# EAGLE design LED_Matrix_3_1 (EAGLE 8.2.2)
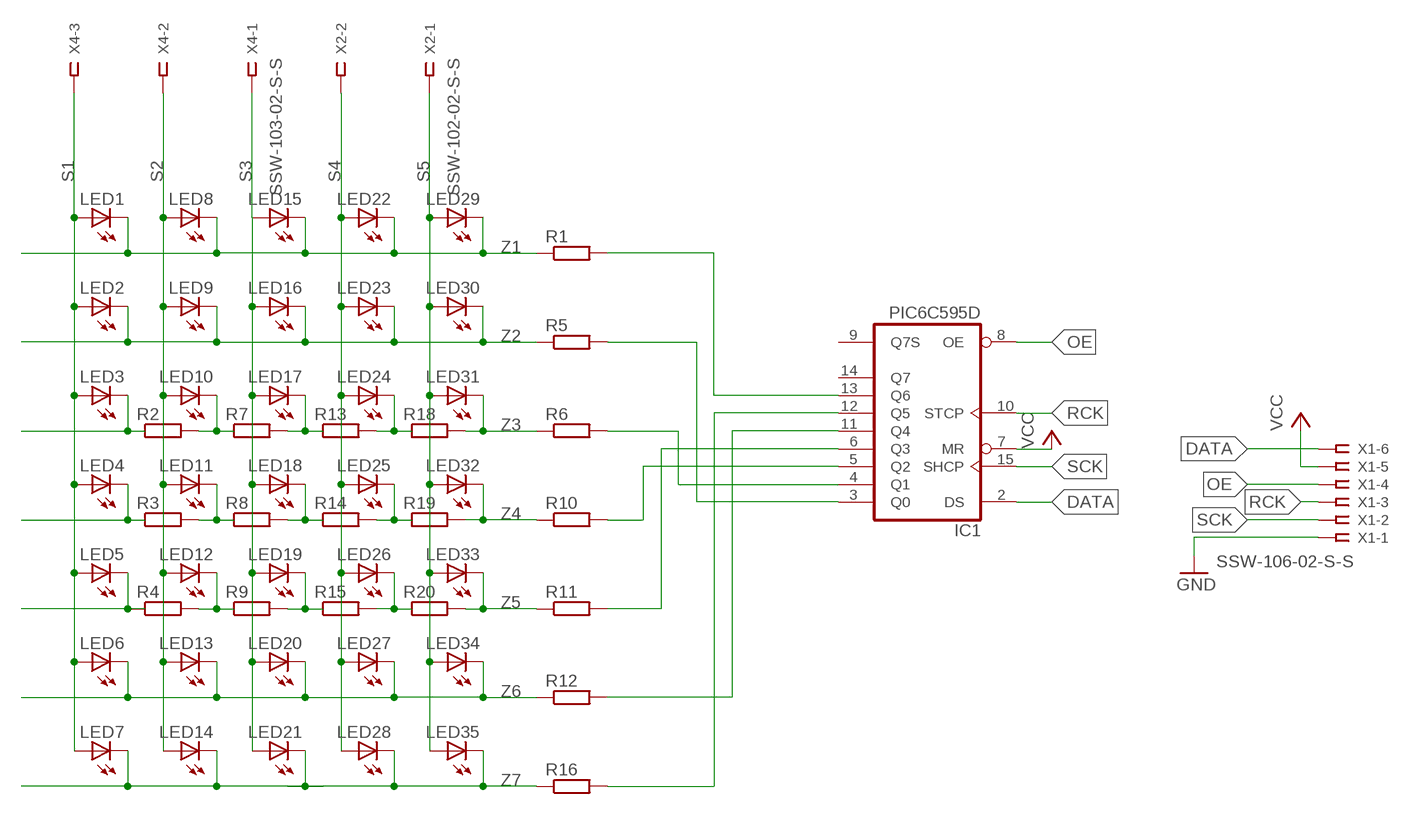
[diagram p0: schematic, sheet 1]

## Parts
IC1  PIC6C595D  [SO16]
LED1  LEDCHIP-LED0603  [CHIP-LED0603]
LED2  LEDCHIP-LED0603  [CHIP-LED0603]
LED3  LEDCHIP-LED0603  [CHIP-LED0603]
LED4  LEDCHIP-LED0603  [CHIP-LED0603]
LED5  LEDCHIP-LED0603  [CHIP-LED0603]
LED6  LEDCHIP-LED0603  [CHIP-LED0603]
LED7  LEDCHIP-LED0603  [CHIP-LED0603]
LED8  LEDCHIP-LED0603  [CHIP-LED0603]
LED9  LEDCHIP-LED0603  [CHIP-LED0603]
LED10  LEDCHIP-LED0603  [CHIP-LED0603]
LED11  LEDCHIP-LED0603  [CHIP-LED0603]
LED12  LEDCHIP-LED0603  [CHIP-LED0603]
LED13  LEDCHIP-LED0603  [CHIP-LED0603]
LED14  LEDCHIP-LED0603  [CHIP-LED0603]
LED15  LEDCHIP-LED0603  [CHIP-LED0603]
LED16  LEDCHIP-LED0603  [CHIP-LED0603]
LED17  LEDCHIP-LED0603  [CHIP-LED0603]
LED18  LEDCHIP-LED0603  [CHIP-LED0603]
LED19  LEDCHIP-LED0603  [CHIP-LED0603]
LED20  LEDCHIP-LED0603  [CHIP-LED0603]
LED21  LEDCHIP-LED0603  [CHIP-LED0603]
LED22  LEDCHIP-LED0603  [CHIP-LED0603]
LED23  LEDCHIP-LED0603  [CHIP-LED0603]
LED24  LEDCHIP-LED0603  [CHIP-LED0603]
LED25  LEDCHIP-LED0603  [CHIP-LED0603]
LED26  LEDCHIP-LED0603  [CHIP-LED0603]
LED27  LEDCHIP-LED0603  [CHIP-LED0603]
LED28  LEDCHIP-LED0603  [CHIP-LED0603]
LED29  LEDCHIP-LED0603  [CHIP-LED0603]
LED30  LEDCHIP-LED0603  [CHIP-LED0603]
LED31  LEDCHIP-LED0603  [CHIP-LED0603]
LED32  LEDCHIP-LED0603  [CHIP-LED0603]
LED33  LEDCHIP-LED0603  [CHIP-LED0603]
LED34  LEDCHIP-LED0603  [CHIP-LED0603]
LED35  LEDCHIP-LED0603  [CHIP-LED0603]
R1  R-EU_R0603  [R0603]
R2  R-EU_R0603  [R0603]
R3  R-EU_R0603  [R0603]
R4  R-EU_R0603  [R0603]
R5  R-EU_R0603  [R0603]
R6  R-EU_R0603  [R0603]
R7  R-EU_R0603  [R0603]
R8  R-EU_R0603  [R0603]
R9  R-EU_R0603  [R0603]
R10  R-EU_R0603  [R0603]
R11  R-EU_R0603  [R0603]
R12  R-EU_R0603  [R0603]
R13  R-EU_R0603  [R0603]
R14  R-EU_R0603  [R0603]
R15  R-EU_R0603  [R0603]
R16  R-EU_R0603  [R0603]
R18  R-EU_R0603  [R0603]
R19  R-EU_R0603  [R0603]
R20  R-EU_R0603  [R0603]
X1  SSW-106-02-S-S  [SSW-106-02-S-S]
X2  SSW-102-02-S-S  [SSW-102-02-S-S]
X4  SSW-103-02-S-S  [SSW-103-02-S-S]

## Nets
DATA: IC1.2(DS) X1.6
GND: X1.1
N$1: IC1.13(Q6) R1.2
N$2: IC1.12(Q5) R16.2
N$3: IC1.11(Q4) R12.2
N$4: IC1.4(Q1) R6.2
N$5: IC1.3(Q0) R5.2
N$6: IC1.6(Q3) R11.2
N$7: IC1.5(Q2) R10.2
N$9: LED4.C R3.1
N$17: LED10.C R2.2 R7.1
N$18: LED17.C R7.2 R13.1
N$19: LED24.C R13.2 R18.1
N$21: LED25.C R14.2 R19.1
N$22: LED18.C R8.2 R14.1
N$23: LED11.C R3.2 R8.1
N$29: LED12.C R4.2 R9.1
N$30: LED19.C R9.2 R15.1
N$35: LED26.C R15.2 R20.1
N$36: LED5.C R4.1
N$53: LED3.C R2.1
OE: IC1.8(OE) X1.4
RCK: IC1.10(STCP) X1.3
S1: LED1.A LED2.A LED3.A LED4.A LED5.A LED6.A LED7.A X4.3
S2: LED8.A LED9.A LED10.A LED11.A LED12.A LED13.A LED14.A X4.2
S3: LED15.A LED16.A LED17.A LED18.A LED19.A LED20.A LED21.A X4.1
S4: LED22.A LED23.A LED24.A LED25.A LED26.A LED27.A LED28.A X2.2
S5: LED29.A LED30.A LED31.A LED32.A LED33.A LED34.A LED35.A X2.1
SCK: IC1.15(SHCP) X1.2
VCC: IC1.7(MR) X1.5
Z1: LED1.C LED8.C LED15.C LED22.C LED29.C R1.1
Z2: LED2.C LED9.C LED16.C LED23.C LED30.C R5.1
Z3: LED31.C R6.1 R18.2
Z4: LED32.C R10.1 R19.2
Z5: LED33.C R11.1 R20.2
Z6: LED6.C LED13.C LED20.C LED27.C LED34.C R12.1
Z7: LED7.C LED14.C LED21.C LED28.C LED35.C R16.1
Unconnected: IC1.9(Q7S) IC1.14(Q7)

## Power pins joined to a net without a drawn wire
GND: IC1.16(GND)
VCC: IC1.1(VCC)

## Library data of the parts
IC1 = PIC6C595:PIC6C595: Power Logic 8-Bit Shift Register The PIC6C595 is an 8-bit serial-in/serial or parallel-out shift register with a storage register and open-drain outputs designed for use in systems that require relatively moderate load power such as LEDs. The device contains a built-in voltage clamp on the outputs for inductive transient protection. Power driver applications include relays, solenoids, and other low-current or medium-voltage loads.
LED1-LED35 = led:LED: LED OSRAM: - CHIPLED LG R971, LG N971, LY N971, LG Q971, LY Q971, LO R971, LY R971 LH N974, LH R974 LS Q976, LO Q976, LY Q976 LO Q996 - Hyper CHIPLED LW Q18S LB Q993, LB Q99A, LB R99A - SideLED LS A670, LO A670, LY A670, LG A670, LP A670 LB A673, LV A673, LT A673, LW A673 LH A674 LY A675 LS A676, LA A676, LO A676, LY A676, LW A676 LS A679, LY A679, LG A679 - Hyper Micro SIDELED® LS Y876, LA Y876, LO Y876, LY Y876 LT Y87S - SmartLED LW L88C, LW L88S LB L89C, LB L89S, LG L890 LS L89K, LO L89K, LY L89K LS L896, LA L896, LO L896, LY L896 - TOPLED LS T670, LO T670, LY T670, LG T670, LP T670 LSG T670, LSP T670, LSY T670, LOP T670, LYG T670 LG T671, LOG T671, LSG T671 LB T673, LV T673, LT T673, LW T673 LH T674 LS T676, LA T676, LO T676, LY T676, LB T676, LH T676, LSB T676, LW T676 LB T67C, LV T67C, LT T67C, LS T67K, LO T67K, LY T67K, LW E67C LS E67B, LA E67B, LO E67B, LY E67B, LB E67C, LV E67C, LT E67C LW T67C LS T679, LY T679, LG T679 LS T770, LO T770, LY T770, LG T770, LP T770 LB T773, LV T773, LT T773, LW T773 LH T774 LS E675, LA E675, LY E675, LS T675 LS T776, LA T776, LO T776, LY T776, LB T776 LHGB T686 LT T68C, LB T68C - Hyper Mini TOPLED® LB M676 - Mini TOPLED Santana® LG M470 LS M47K, LO M47K, LY M47K Source: http://www.osram.convergy.de LUXEON: - LUMILED® LXK2-PW12-R00, LXK2-PW12-S00, LXK2-PW14-U00, LXK2-PW14-V00 LXK2-PM12-R00, LXK2-PM12-S00, LXK2-PM14-U00 LXK2-PE12-Q00, LXK2-PE12-R00, LXK2-PE12-S00, LXK2-PE14-T00, LXK2-PE14-U00 LXK2-PB12-K00, LXK2-PB12-L00, LXK2-PB12-M00, LXK2-PB14-N00, LXK2-PB14-P00, LXK2-PB14-Q00 LXK2-PR12-L00, LXK2-PR12-M00, LXK2-PR14-Q00, LXK2-PR14-R00 LXK2-PD12-Q00, LXK2-PD12-R00, LXK2-PD12-S00 LXK2-PH12-R00, LXK2-PH12-S00 LXK2-PL12-P00, LXK2-PL12-Q00, LXK2-PL12-R00 Source: www.luxeon.com KINGBRIGHT: KA-3528ASYC Source: www.kingbright.com
R1 R5 R6 R10-R12 R16 = resistor:R-EU_: RESISTOR, European symbol
R2-R4 R7-R9 R13-R15 R18-R20 = rcl:R-EU_: RESISTOR, European symbol
X1 = con-samtec:SSW-106-02-S-S: THROUGH-HOLE .025" SQ POST SOCKET Source: Samtec SSW.pdf; MPN: SSW-106-02-S-S; OC_FARNELL: unknown; OC_NEWARK: 11P9416
X2 = con-samtec:SSW-102-02-S-S: THROUGH-HOLE .025" SQ POST SOCKET Source: Samtec SSW.pdf; MPN: SSW-102-02-S-S; OC_FARNELL: unknown; OC_NEWARK: 11P9351
X4 = con-samtec:SSW-103-02-S-S: THROUGH-HOLE .025" SQ POST SOCKET Source: Samtec SSW.pdf; MPN: SSW-103-02-S-S; OC_FARNELL: unknown; OC_NEWARK: 11P9367

## Board
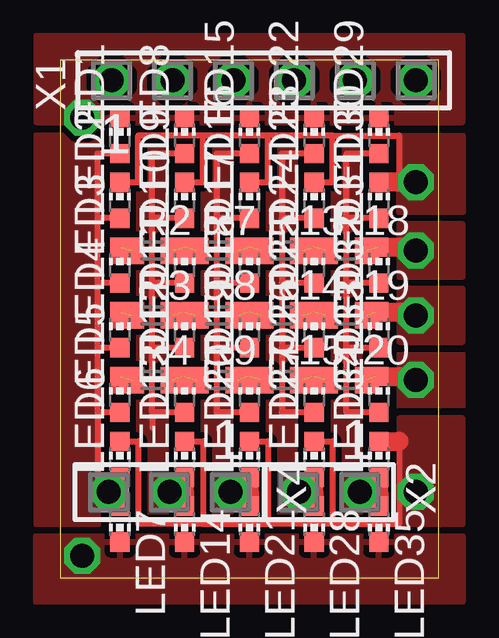
[diagram p1: board, top side]
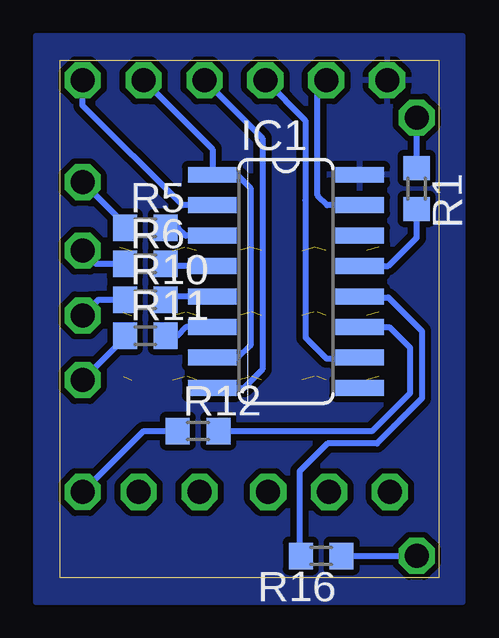
[diagram p2: board, bottom side, seen from below]

Size 15.8 x 21.6 mm. Coordinates in mm from the lower left corner, seen from the top.
Outline: 0,0 15.8,0 15.8,21.6 0,21.6 0,0
Copper layers (1*16): Top 0.035mm / dielectric 1.5mm / Bottom 0.035mm
Design rules "default *": minimum track width 10mil, minimum drill 24mil, track to track 10mil, track to pad 10mil, pad to pad 10mil, via to via 10mil, smd to smd 8mil, copper to edge 0mil, drill to drill 8mil, minimum pad ring 10mil, minimum via ring 8mil, stop-mask expansion 4mil, vias tented up to drill 0mil, thermal gap 10mil

### Footprints (pad centres in the part's own frame; a part is rotated, then mirrored left to right if it is on the bottom)
SO16 = smd 0.66 x 2.032: 1 -4.445,-3.073; 2 -3.175,-3.073; 3 -1.905,-3.073; 4 -0.635,-3.073; 5 0.635,-3.073; 6 1.905,-3.073; 7 3.175,-3.073; 8 4.445,-3.073; 9 4.445,3.073; 10 3.175,3.073; 11 1.905,3.073; 12 0.635,3.073; 13 -0.635,3.073; 14 -1.905,3.073; 15 -3.175,3.073; 16 -4.445,3.073
CHIP-LED0603 = smd 0.8 x 0.8: A 0,-0.75; C 0,0.75
R0603 = smd 1 x 1.1: 1 -0.85,0; 2 0.85,0
SSW-106-02-S-S = drill 1 pad 1.5 octagon: 1 -6.35,0; 2 -3.81,0; 3 -1.27,0; 4 1.27,0; 5 3.81,0; 6 6.35,0
SSW-102-02-S-S = drill 1 pad 1.5 octagon: 1 -1.27,0; 2 1.27,0
SSW-103-02-S-S = drill 1 pad 1.5 octagon: 1 -2.54,0; 2 0,0; 3 2.54,0

### Placement (x,y rotation side)
IC1  6.37,12.37 270 bottom
LED1  2.5,18.45 0 top
LED2  2.5,15.75 0 top
LED3  2.5,13.05 0 top
LED4  2.5,10.35 0 top
LED5  2.5,7.65 0 top
LED6  2.5,4.95 0 top
LED7  2.5,2.25 180 top
LED8  5.2,18.45 0 top
LED9  5.2,15.75 0 top
LED10  5.2,13.05 0 top
LED11  5.2,10.35 0 top
LED12  5.2,7.65 0 top
LED13  5.2,4.95 0 top
LED14  5.2,2.25 180 top
LED15  7.9,18.45 0 top
LED16  7.9,15.75 0 top
LED17  7.9,13.05 0 top
LED18  7.9,10.35 0 top
LED19  7.9,7.65 0 top
LED20  7.9,4.95 0 top
LED21  7.9,2.25 180 top
LED22  10.6,18.45 0 top
LED23  10.6,15.75 0 top
LED24  10.6,13.05 0 top
LED25  10.6,10.35 0 top
LED26  10.6,7.65 0 top
LED27  10.6,4.95 0 top
LED28  10.6,2.25 180 top
LED29  13.3,18.45 0 top
LED30  13.3,15.75 0 top
LED31  13.3,13.05 0 top
LED32  13.3,10.35 0 top
LED33  13.3,7.65 0 top
LED34  13.3,4.95 0 top
LED35  13.3,2.25 180 top
R1  0.92,16.24 270 bottom
R2  3.85,13.65 0 top
R3  3.85,10.95 0 top
R4  3.85,8.25 0 top
R5  12.23,14.6 0 bottom
R6  12.23,13.1 0 bottom
R7  6.55,13.65 0 top
R8  6.55,10.95 0 top
R9  6.55,8.25 0 top
R10  12.23,11.6 0 bottom
R11  12.23,10.1 0 bottom
R12  10.03,6.13 0 bottom
R13  9.25,13.65 0 top
R14  9.25,10.95 0 top
R15  9.25,8.25 0 top
R16  4.9,0.92 180 bottom
R18  11.95,13.65 0 top
R19  11.95,10.95 0 top
R20  11.95,8.25 0 top
X1  8.5,20.75 0 top
X2  11.24,3.58 180 top
X4  4.57,3.58 180 top

### Tracks (layer width: path | path; a pad name or v marks a point on that pad's centre or on a via)
DATA
  Bottom 0.254: IC1.2 10.69,15.54 14.85,19.7 X1.6
GND
  pour Bottom: -1,22.6 16.8,22.6 16.8,-1 -1,-1
N$1
  Bottom 0.254: IC1.13 3.28,13.01 2.1,13.01 0.92,14.19 R1.2
N$2
  Bottom 0.254: IC1.12 3.27,11.7 2.1,11.7 0.69,10.29 0.69,7.49 2.58,5.61 4.64,5.61 5.8,4.45 5.8,0.97 R16.2
N$3
  Bottom 0.254: R12.2 9.18,6.12 2.79,6.12 1.2,7.7 1.2,9.6 2.06,10.46 IC1.11
N$4
  Bottom 0.254: IC1.4 11.38,13 R6.2
N$5
  Bottom 0.254: IC1.3 10.54,14.27 10.87,14.6 R5.2
N$6
  Bottom 0.254: IC1.6 10.54,10.46 10.9,10.1 R11.2
N$7
  Bottom 0.254: IC1.5 11.25,11.73 R10.2
N$9  (1 unrouted)
N$17  (2 unrouted)
N$18  (2 unrouted)
N$19  (2 unrouted)
  Top 0.254: 10.49,13.77 LED24.C 10.49,13.77
  Top 0.406: 10.49,13.76 LED24.C
N$21  (2 unrouted)
  Top 0.254: 10.49,11.08 LED25.C
N$22  (2 unrouted)
  Top 0.254: 7.81,11.08 LED18.C
  Top 0.406: 7.81,11.08 LED18.C
N$23  (2 unrouted)
  Top 0.406: 5.07,11.08 LED11.C
N$29  (2 unrouted)
  Top 0.406: 5.07,8.41 LED12.C
N$30  (2 unrouted)
  Top 0.254: 7.81,8.41 LED19.C
  Top 0.406: 7.81,8.41 LED19.C
N$35  (2 unrouted)
  Top 0.254: 10.5,8.4 LED26.C 10.5,8.41
  Top 0.406: 10.5,8.4 LED26.C
N$36  (1 unrouted)
N$53  (1 unrouted)
OE
  Bottom 0.254: IC1.8 8.13,7.92 7.35,8.7 7.35,18.33 X1.4
RCK
  Bottom 0.254: IC1.10 3.33,9.15 4.68,9.15 5.55,10.02 5.55,15.73 5.56,15.74 5.56,19.08 X1.3
S1
  Top 0.254: LED1.A 1.57,17.7 1.57,15 | 1.57,12.3 1.57,15 | 1.57,9.6 1.57,12.3 | 1.57,6.9 1.57,9.6 | 1.57,6.9 1.57,3.94 | LED2.A 1.57,15 | LED3.A 1.57,12.3 | LED4.A 1.57,9.6 | LED5.A 1.57,6.9 | X4.3 2.5,3.58 2.5,3.56
  Top 0.8: LED6.A 2.5,3.56 LED7.A
  pour Top (isolate 0.254, rank 2, no thermals): 1.56,18.45 -1,18.45 -1,2.25 1.6,2.25
S2
  Top 0.254: 5.07,17.77 LED8.A 3.85,17.7 3.85,15 | 3.85,12.3 3.85,15 | 3.85,9.6 3.85,12.3 | LED9.A 3.85,15 | LED10.A 3.85,12.3 | LED11.A 3.85,9.6 | LED12.A 3.85,6.9 | 3.85,6.9 3.85,9.6 | 3.85,6.9 3.85,6.26 | X4.2 5.2,3.58
  Top 0.8: LED13.A 5.2,3.58 LED14.A
  pour Top (isolate 0.254, rank 2, no thermals): 4.4,18.45 4.4,2.25 3.3,2.25 3.3,18.45
S3
  Top 0.254: 6.55,15 6.55,17.7 LED15.A | 6.55,12.3 6.55,15 | 6.55,9.6 6.55,12.3 | 6.55,9.6 6.55,6.9 LED19.A | LED16.A 6.55,15 | LED17.A 6.55,12.3 | LED18.A 6.55,9.6 | X4.1 7.9,3.58 7.9,3.6
  Top 0.8: LED20.A 7.9,3.6 LED21.A
  pour Top (isolate 0.254, rank 2, no thermals): 6,18.45 7.1,18.45 7.1,2.25 6,2.25
S4
  Top 0.254: 9.25,9.6 9.25,6.9 | 9.25,12.3 9.25,9.6 | 9.25,15 9.25,12.3 | 9.25,15 9.25,17.7 LED22.A 10.49,17.74 | 9.45,6.9 9.25,6.9 | LED26.A 9.25,6.9 | LED25.A 9.25,9.6 | LED24.A 9.25,12.3 | LED23.A 9.25,15 | X2.2 10.6,3.58 10.6,3.54
  Top 0.8: LED27.A 10.6,3.54 LED28.A
  pour Top (isolate 0.254, rank 2, no thermals): 9.8,18.45 8.7,18.45 8.7,2.25 9.8,2.25
S5
  Top 0.254: 11.95,15 11.95,17.7 LED29.A 13.16,17.74 | 11.95,12.3 11.95,15 | 11.95,9.6 11.95,12.3 | 11.95,6.9 11.95,9.6 | 11.95,6.9 11.95,6.89 | LED30.A 11.95,15 | LED31.A 11.95,12.3 | LED32.A 11.95,9.6 | LED33.A 11.95,6.9 | X2.1 13.3,3.58 13.3,3.56
  Top 0.8: LED34.A 13.3,3.56 LED35.A
  pour Top (isolate 0.254, rank 2, no thermals): 12.5,18.45 11.4,18.45 11.4,2.25 12.5,2.25
SCK
  Bottom 0.254: IC1.15 4.64,15.54 5.05,15.95 5.05,20.39 X1.2
VCC
  Bottom 0.254: IC1.1 9.41,16.84 9.35,16.77 | IC1.7 8.36,9.19 7.86,9.69 7.86,16.26 8.4,16.8 9.43,16.8 IC1.1 | X1.5 9.44,17.88 IC1.1
Z1  (via drill 1)
  Top 0.406: 5.07,19.26 LED8.C | 7.81,19.27 LED15.C
  Bottom 0.254: R1.1 v0.92,19.2
  pour Top (isolate 0.305): -1,19.01 16.8,19.01 16.8,22.6 -1,22.6
Z2  (via drill 1)
  Top 0.254: 5.07,16.52 LED9.C | 7.8,16.5 LED16.C 8.67,16.5 8.67,18.45 | 10.49,16.5 LED23.C 11.37,16.5 11.37,18.45 | 5.07,16.51 LED9.C | 5.97,18.45 3.27,18.45 3.27,16.5 LED2.C | 8.67,18.45 5.97,18.45 | 11.37,18.45 8.67,18.45 | 11.37,18.45 14.15,18.45 14.15,16.5 | LED9.C 5.97,16.5 5.97,18.45
  Top 0.8: LED30.C 14.15,16.5 v14.85,16.5
  Bottom 0.254: R5.1 13.08,14.73 v14.85,16.5
  pour Top (isolate 0.254): 14.15,18.45 16.8,18.45 16.8,15.25 14.15,15.25
Z3  (via drill 1)  (1 unrouted)
  Top 0.8: LED31.C 14.7,13.8 v14.85,13.65
  Bottom 0.254: R6.1 14.3,13.1 v14.85,13.65
  pour Top (isolate 0.254, rank 2): 14.15,14.75 14.15,12.55 16.8,12.55 16.8,14.75
Z4  (via drill 1)  (1 unrouted)
  Top 0.254: 13.16,11.08 LED32.C
  Top 0.8: LED32.C 14.7,11.1 v14.85,10.95
  Bottom 0.254: R10.1 14.2,11.6 v14.85,10.95
  pour Top (isolate 0.254): 14.15,12.05 14.15,9.85 16.8,9.85 16.8,12.05
Z5  (via drill 1)  (1 unrouted)
  Top 0.254: 13.15,8.4 LED33.C
  Top 0.406: 13.15,8.4 LED33.C
  Top 0.8: LED33.C 14.7,8.4 v14.85,8.25
  Bottom 0.254: R11.1 13.08,10.02 v14.85,8.25
  pour Top (isolate 0.305, rank 2): 14.15,9.35 14.15,7.15 16.8,7.15 16.8,9.35
Z6  (via drill 1)
  Top 0.254: 13.15,5.66 LED34.C 13.15,5.65 | 5.08,5.68 LED13.C | 7.81,5.67 LED20.C | 7.81,5.72 LED20.C | 10.49,5.67 LED27.C 11.37,5.7 11.37,2.25 | 5.08,5.67 LED13.C | 5.97,2.25 3.27,2.25 3.27,5.7 LED6.C 2.38,5.68 | 5.97,2.25 8.67,2.25 | 8.67,2.25 | 11.37,2.25 8.67,2.25 | 11.37,2.25 14.15,2.25 14.15,5.7 | LED13.C 5.97,5.7 5.97,2.25 | LED20.C 8.67,5.7 8.67,2.25 | 8.67,2.25
  Top 0.406: 13.15,5.67 LED34.C | 5.08,5.68 LED13.C | 10.49,5.66 LED27.C
  Top 0.8: LED34.C 14.15,5.7
  Bottom 0.254: v14.85,3.58 12.3,6.13 R12.1
  pour Top (isolate 0.305): 14.15,6.65 14.15,2.25 16.8,2.25 16.8,6.65
Z7  (via drill 1)
  Top 0.406: 10.49,1.51 LED28.C 10.49,1.49 | 13.15,1.5 LED35.C | 5.08,1.5 LED14.C 5.08,1.45 | 2.38,1.5 LED7.C | 7.81,1.5 LED21.C
  Bottom 0.254: 4.1,0.93 R16.1 v0.92,0.92
  pour Top (isolate 0.254): 16.8,1.74 16.8,-1 -1,-1 -1,1.74
(copper drawn outside any net)
  shapes: Top area x3

### Text on the board
Document: Zusatzanzeiger